# EAGLE design hf-controller (EAGLE 7.4.0)
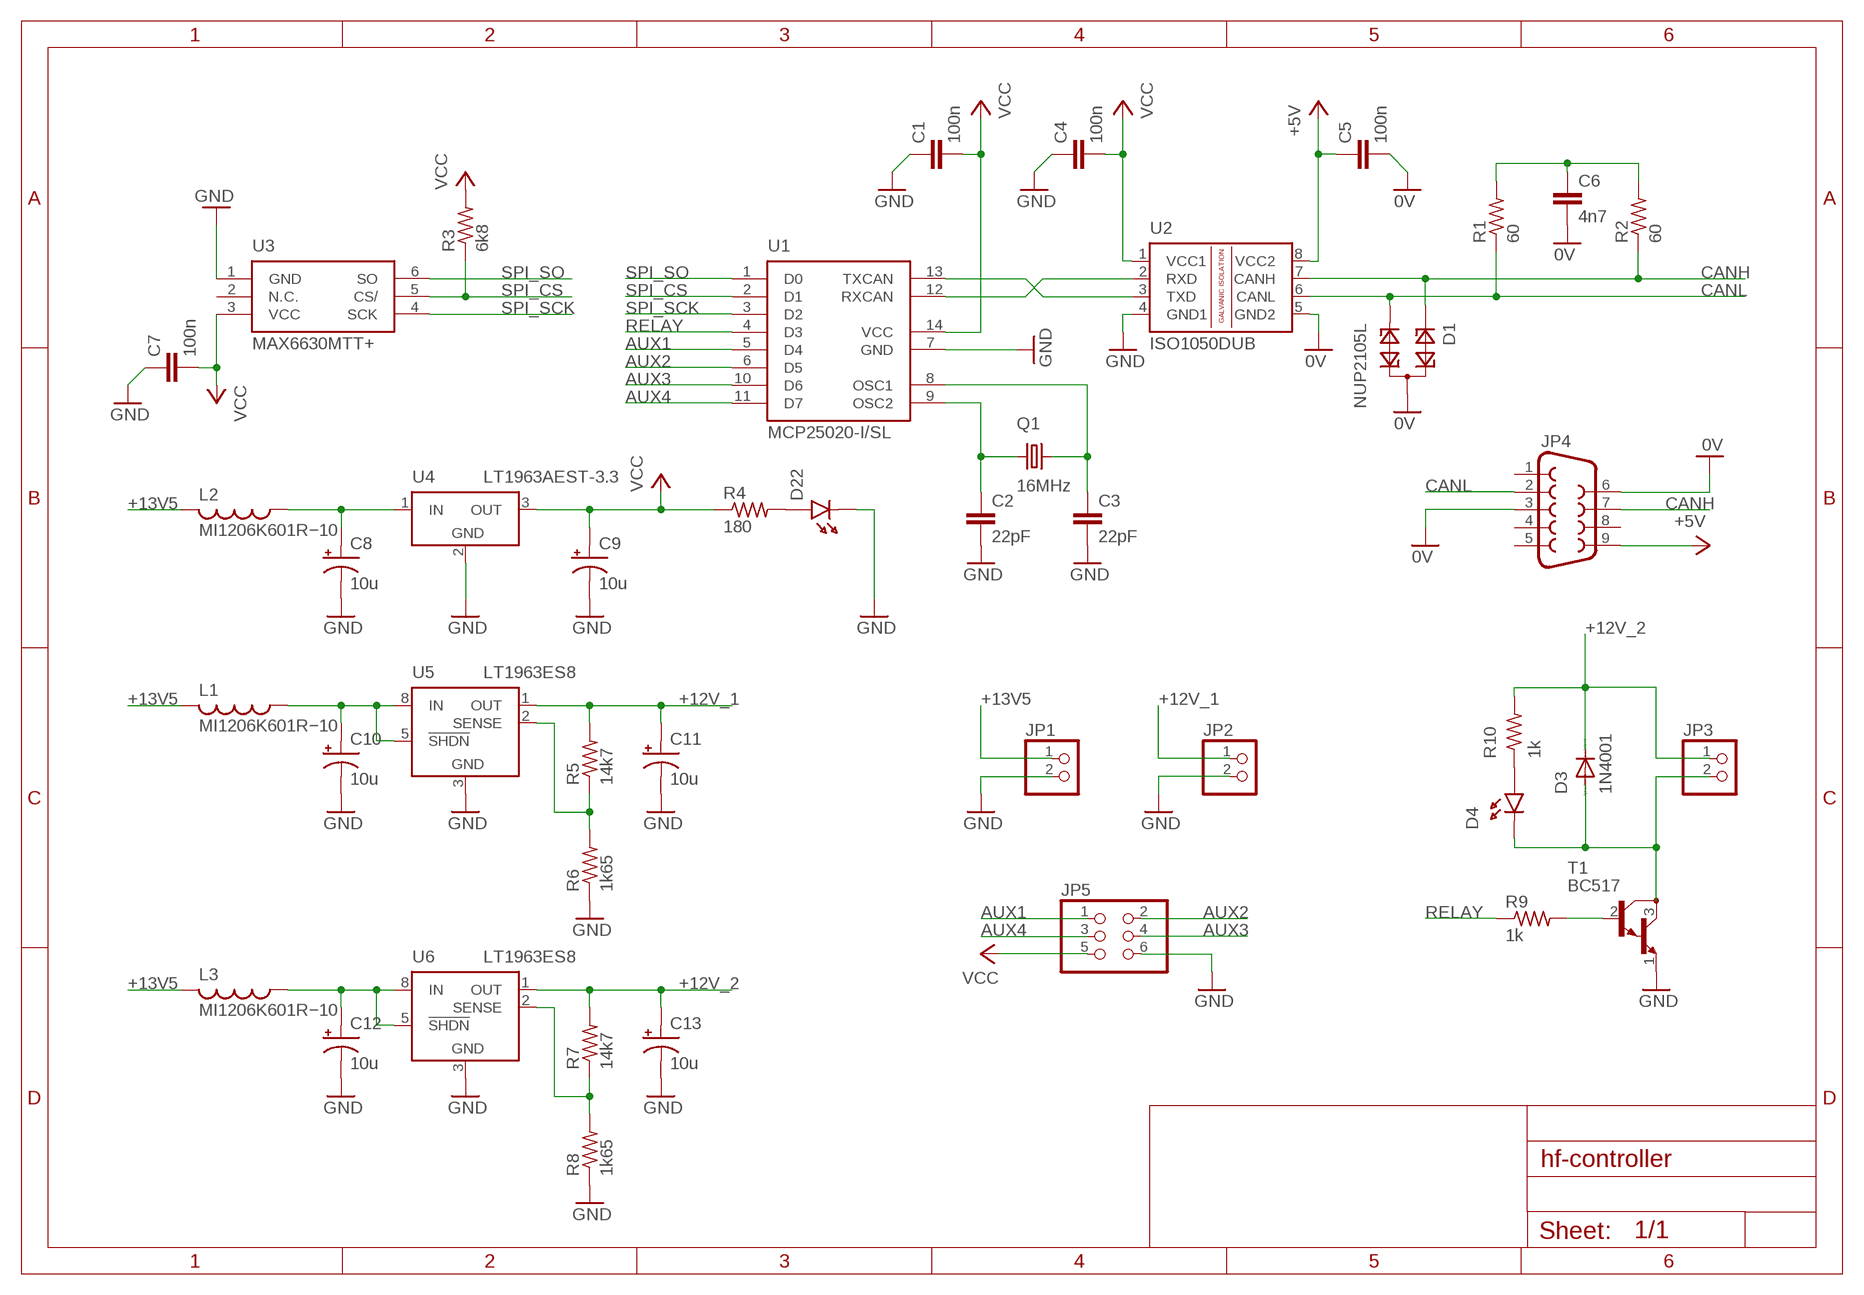
[diagram p0: schematic, sheet 1]

## Parts
C1  100n  C-EUC0805  [C0805]
C2  22pF  C-EUC0805  [C0805]
C3  22pF  C-EUC0805  [C0805]
C4  100n  C-EUC0805  [C0805]
C5  100n  C-EUC0805  [C0805]
C6  4n7  C-EUC0805  [C0805]
C7  100n  C-EUC0805  [C0805]
C8  10u  CAPACITOR_POL1012  [CAPACITOR_POL_1210]
C9  10u  CAPACITOR_POL1012  [CAPACITOR_POL_1210]
C10  10u  CAPACITOR_POL1012  [CAPACITOR_POL_1210]
C11  10u  CAPACITOR_POL1012  [CAPACITOR_POL_1210]
C12  10u  CAPACITOR_POL1012  [CAPACITOR_POL_1210]
C13  10u  CAPACITOR_POL1012  [CAPACITOR_POL_1210]
D1  NUP2105L  PESD1CAN  [SOT23]
D3  1N4001  DIODE-DO41-10  [DO41-10]
D4  LED  [LED_1206]
D22  LED  [LED_1206]
JP1  PINHD-1X2  [1X02]
JP2  PINHD-1X2  [1X02]
JP3  PINHD-1X2  [1X02]
JP4  F09HP  [F09HP]
JP5  PINHD-2X3  [2X03]
L1  MI1206K601R−10  L-USL3216C  [L3216C]
L2  MI1206K601R−10  L-USL3216C  [L3216C]
L3  MI1206K601R−10  L-USL3216C  [L3216C]
Q1  16MHz  CRYSTALHC49S  [HC49/S]
R1  60  R-US_M0805  [M0805]
R2  60  R-US_M0805  [M0805]
R3  6k8  R-US_R0805  [R0805]
R4  180  R-US_R0805  [R0805]
R5  14k7  R-US_R0805  [R0805]
R6  1k65  R-US_R0805  [R0805]
R7  14k7  R-US_R0805  [R0805]
R8  1k65  R-US_R0805  [R0805]
R9  1k  R-US_R0805  [R0805]
R10  1k  R-US_R1206  [R1206]
T1  BC517  [TO92]
U1  MCP25020-I/SL  MCP25050  [MCP25050]
U2  ISO1050DUB  [DUB-R-PDSO-G8]
U3  MAX6630MTT+  [MAX6630MTT+]
U4  LT1963AEST-3.3  LT1963EST-3.3  [SOT223]
U5  LT1963ES8  [SOIC8]
U6  LT1963ES8  [SOIC8]

## Nets
0V: C5.2 C6.2 D1.3 JP4.3 JP4.6 U2.5(GND2)
+5V: C5.1 JP4.9 U2.8(VCC2)
+12V_1: C11.A JP2.1 R5.2 U5.1(OUT)
+12V_2: C13.A D3.C JP3.1 R7.2 R10.2 U6.1(OUT)
+13V5: JP1.1 L1.2 L2.2 L3.2
AUX1: JP5.1 U1.5(D4)
AUX2: JP5.2 U1.6(D5)
AUX3: JP5.4 U1.10(D6)
AUX4: JP5.3 U1.11(D7)
CANH: D1.1 JP4.7 R2.1 U2.7(CANH)
CANL: D1.2 JP4.2 R1.1 U2.6(CANL)
GND: C1.1 C2.2 C3.2 C4.1 C7.1 C8.C C9.C C10.C C11.C C12.C C13.C D22.C JP1.2 JP2.2 JP5.6 R6.1 R8.1 T1.1(E) U1.7(GND) U2.4(GND1) U3.1(GND) U4.2(GND) U5.3(GND) U6.3(GND)
N$1: U1.13(TXCAN) U2.3(TXD)
N$2: U1.12(RXCAN) U2.2(RXD)
N$3: C2.1 Q1.1 U1.9(OSC2)
N$4: C3.1 Q1.2 U1.8(OSC1)
N$5: C10.A L1.1 U5.5(!SHDN) U5.8(IN)
N$6: R9.2 T1.2(B)
N$7: C12.A L3.1 U6.5(!SHDN) U6.8(IN)
N$8: C6.1 R1.2 R2.2
N$9: C8.A L2.1 U4.1(IN)
N$12: D3.A D4.C JP3.2 T1.3(C)
N$13: R7.1 R8.2 U6.2(SENSE)
N$15: R5.1 R6.2 U5.2(SENSE)
N$18: D22.A R4.2
N$19: D4.A R10.1
RELAY: R9.1 U1.4(D3)
SPI_CS: R3.1 U1.2(D1) U3.5(CS/)
SPI_SCK: U1.3(D2) U3.4(SCK)
SPI_SO: U1.1(D0) U3.6(SO)
VCC: C1.2 C4.2 C7.2 C9.A JP5.5 R3.2 R4.1 U1.14(VCC) U2.1(VCC1) U3.3(VCC) U4.3(OUT)
Unconnected: JP4.1 JP4.4 JP4.5 JP4.8 U3.2(N.C.) U5.4(NC) U6.4(NC)

## Power pins joined to a net without a drawn wire
GND: U4.4(GND) U5.6(GND) U5.7(GND) U6.6(GND) U6.7(GND)

## Library data of the parts
C1-C7 = rcl:C-EU: CAPACITOR, European symbol
C8-C13 = hf-controller:CAPACITOR_POL
D1 = diode:PESD1CAN: CAN bus ESD protection diode Source: http://www.nxp.com/documents/data_sheet/PESD1CAN.pdf
D3 = diode:DIODE-: DIODE
D4 D22 = hf-controller:LED
JP1-JP3 = pinhead:PINHD-1X2: PIN HEADER
JP4 = con-subd:F09: SUB-D; OC_FARNELL: unknown; OC_NEWARK: unknown
JP5 = pinhead:PINHD-2X3: PIN HEADER
L1-L3 = rcl:L-US: INDUCTOR, American symbol
Q1 = crystal:CRYSTAL: CRYSTAL; OC_FARNELL: 1667008; OC_NEWARK: unknown
R1-R3 R5-R8 R10 = resistor:R-US_: RESISTOR, American symbol
R4 R9 = rcl:R-US_: RESISTOR, American symbol
T1 = transistor:BC517: NPN BIPOLAR DARLINGTON TRANSISTOR
U1 = hf-controller:MCP25050
U2 = texas:ISO1050: ISOLATED CAN TRANSCEIVER Source: http://focus.ti.com/lit/ds/symlink/iso1050.pdf; MPN: ISO1050DUBR; OC_FARNELL: 1755712; OC_NEWARK: 14R9899
U3 = hf-controller:MAX6630MTT+
U4 = linear-technology:LT1963EST: 1.5A, Low Noise, Fast Transient Response LDO Regulator Source: http://www.linear.com/pc/downloadDocument.do?navId=H0,C3,P2222,D3148; MPN: LT1963EST-3.3; OC_FARNELL: 1501032; OC_NEWARK: 57M7546
U5 U6 = linear-technology:LT1963ES8: 1.5A, Low Noise, Fast Transient Response LDO Regulator Source: http://www.linear.com/pc/downloadDocument.do?navId=H0,C3,P2222,D3148; MPN: LT1963ES8; OC_FARNELL: unknown; OC_NEWARK: 57M7550

## Board
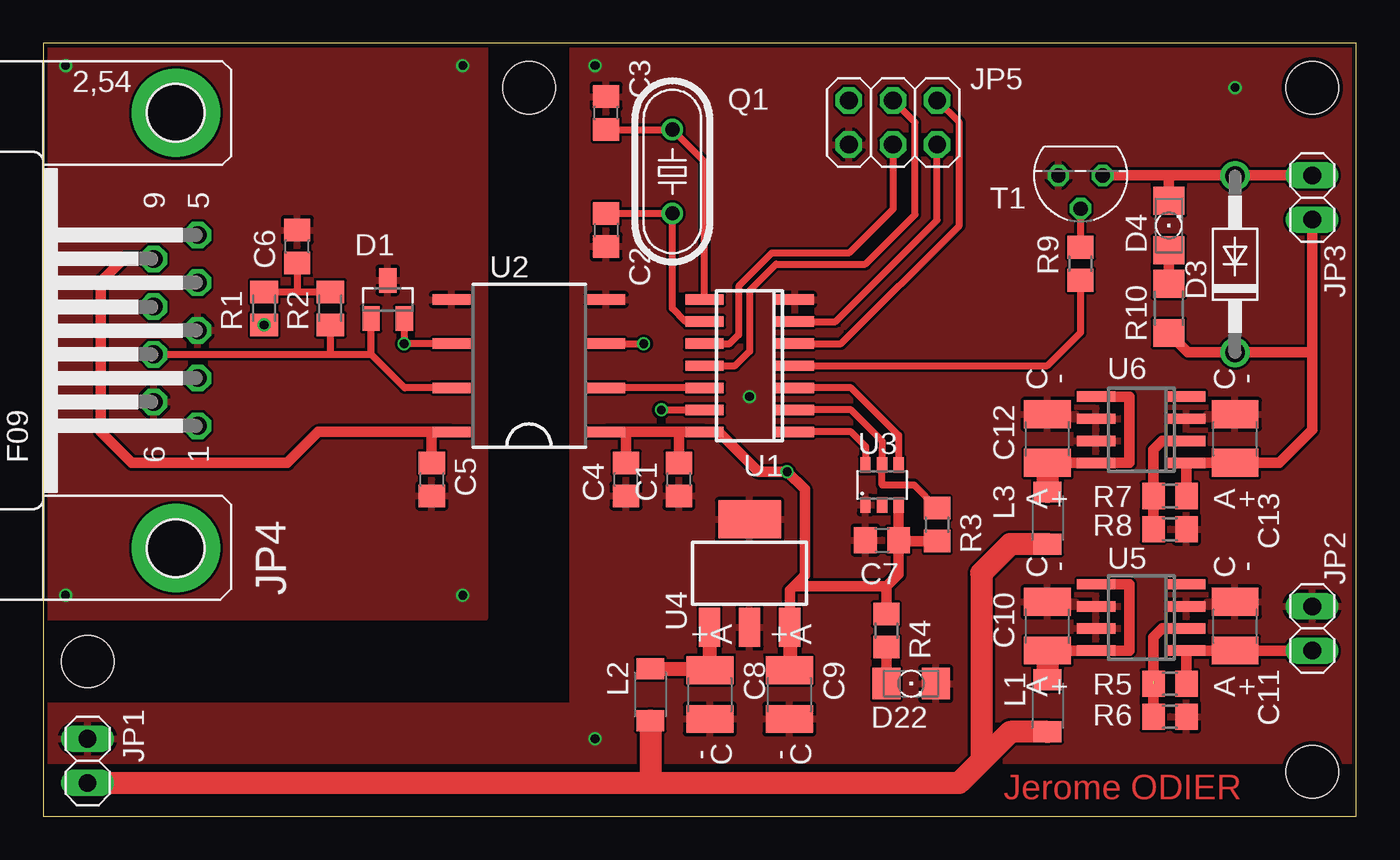
[diagram p1: board, top side]
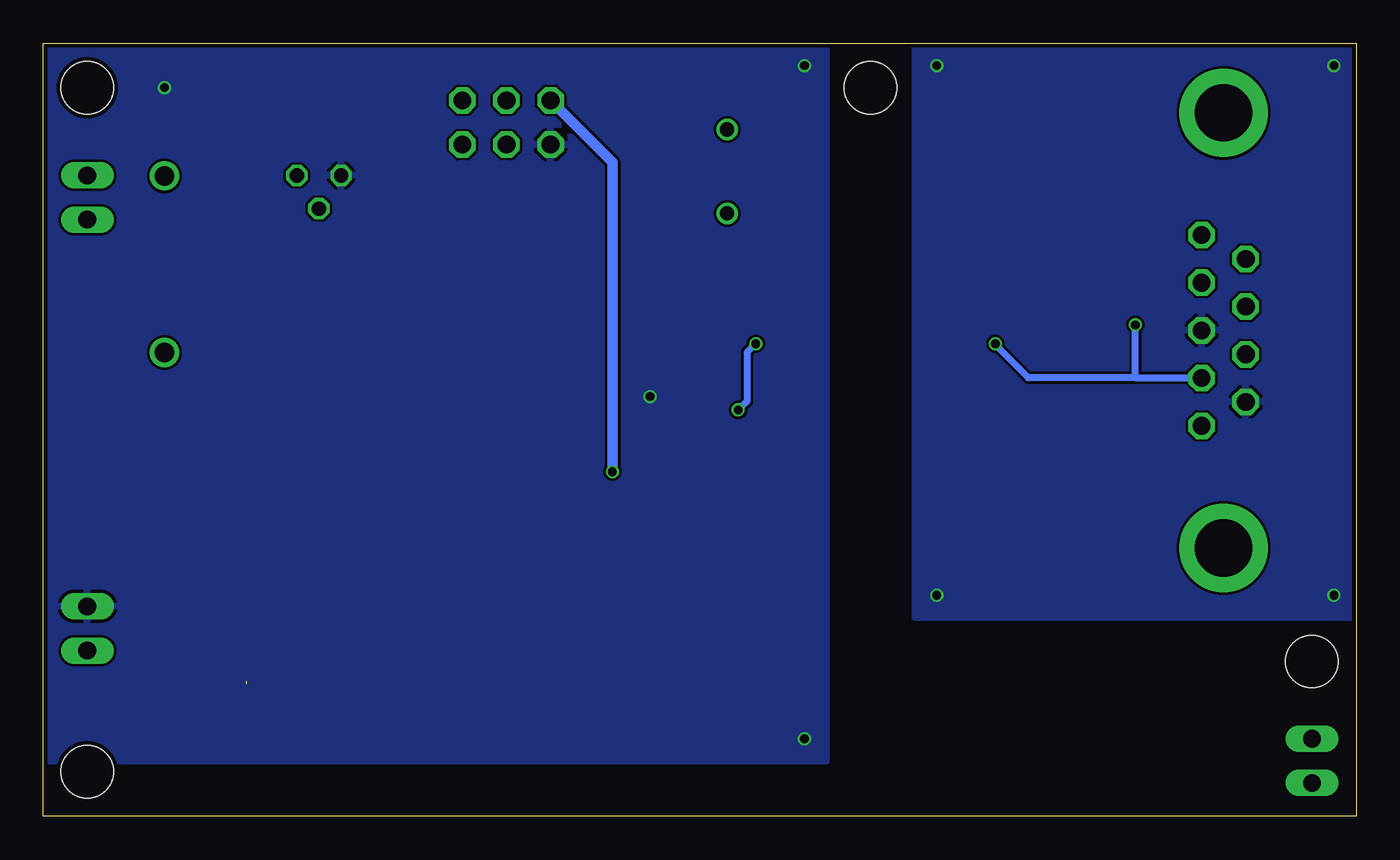
[diagram p2: board, bottom side, seen from below]

Size 75.55 x 44.45 mm. Coordinates in mm from the lower left corner, seen from the top.
Outline: 0,0 75.55,0 75.55,44.45 0,44.45 0,0
Copper layers (1*16): Top 0.018mm / dielectric 1.55mm / Bottom 0.018mm
Design rules "eC_2Layer_PClass6_BaseCopperO18_eCDefault": minimum track width 0.15mm, minimum drill 0.35mm, track to track 0.15mm, track to pad 0.15mm, pad to pad 0.15mm, via to via 0.15mm, smd to smd 0mil, copper to edge 0.25mm, drill to drill 0.35mm, minimum pad ring 0.175mm, minimum via ring 0.125mm, stop-mask expansion 0mil, vias tented up to drill 0.45mm, thermal gap 0.2mm
Holes 3 mm at 2.54,8.89 73.03,2.54 73.03,41.91 27.94,41.91

### Footprints (pad centres in the part's own frame; a part is rotated, then mirrored left to right if it is on the bottom)
C0805 = smd 1.3 x 1.5: 1 -0.95,0; 2 0.95,0
CAPACITOR_POL_1210 = smd 1.6 x 2.7: A -1.4,0; C 1.4,0
SOT23 = smd 1 x 1.4: 1 -0.95,-1.1; 2 0.95,-1.1; 3 0,1.1
DO41-10 = drill 1.118: A 5.08,0; C -5.08,0
LED_1206 = smd 1.6 x 1.803: A -1.422,0; C 1.422,0
1X02 = drill 1.016 long: 1 -1.27,0; 2 1.27,0
F09HP = drill 1.016 octagon: 1 -5.486,-1.27; 2 -2.743,-1.27; 3 0,-1.27; 4 2.743,-1.27; 5 5.486,-1.27; 6 -4.115,1.27; 7 -1.372,1.27; 8 1.372,1.27; 9 4.115,1.27 | drill 3.302 pad 5.08: G1 -12.522,0; G2 12.522,0
2X03 = drill 1.016 octagon: 1 -2.54,-1.27; 2 -2.54,1.27; 3 0,-1.27; 4 0,1.27; 5 2.54,-1.27; 6 2.54,1.27
L3216C = smd 1.2 x 1.6: 1 -1.5,0; 2 1.5,0
HC49/S = drill 0.813: 1 -2.413,0; 2 2.413,0
M0805 = smd 1.3 x 1.6: 1 -0.95,0; 2 0.95,0
R0805 = smd 1.3 x 1.5: 1 -0.95,0; 2 0.95,0
R1206 = smd 1.6 x 1.803: 1 -1.422,0; 2 1.422,0
TO92 = drill 0.813 octagon: 1 1.27,0; 2 0,1.905; 3 -1.27,0
MCP25050 = smd 0.6 x 2.2: 1 0,-0.06; 2 1.27,-0.06; 3 2.54,-0.06; 4 3.81,-0.06; 5 5.08,-0.06; 6 6.35,-0.06; 7 7.62,-0.06; 8 7.62,5.14; 9 6.35,5.14; 10 5.08,5.14; 11 3.81,5.14; 12 2.54,5.14; 13 1.27,5.14; 14 0,5.14
DUB-R-PDSO-G8 = smd 0.6 x 2.2: 1 -3.81,-4.445; 2 -1.27,-4.445; 3 1.27,-4.445; 4 3.81,-4.445; 5 3.81,4.445; 6 1.27,4.445; 7 -1.27,4.445; 8 -3.81,4.445
MAX6630MTT+ = smd 0.6 x 0.9: 1 -0.95,-1.15; 2 0,-1.15; 3 0.95,-1.15; 4 0.95,1.15; 5 0,1.15; 6 -0.95,1.15
SOT223 = smd 1.219 x 2.235: 1 -2.311,-3.099; 2 0,-3.099; 3 2.311,-3.099 | smd 3.6 x 2.2: 4 0,3.099
SOIC8 = smd 0.6 x 2.2: 1 -1.905,-2.6; 2 -0.635,-2.6; 3 0.635,-2.6; 4 1.905,-2.6; 5 1.905,2.6; 6 0.635,2.6; 7 -0.635,2.6; 8 -1.905,2.6

### Placement (x,y rotation side)
C1  36.58,19.37 90 top
C2  32.38,33.72 270 top
C3  32.38,40.45 90 top
C4  33.53,19.37 90 top
C5  22.35,19.37 270 top
C6  14.61,32.77 90 top
C7  48.26,15.88 0 top
C8  38.35,6.99 270 top
C9  42.93,6.99 270 top
C10  57.78,10.92 90 top
C11  68.58,10.92 90 top
C12  57.78,21.72 90 top
C13  68.58,21.72 90 top
D1  19.81,29.72 0 top
D3  68.58,31.75 90 top
D4  64.77,33.97 90 top
D22  49.94,7.62 0 top
JP1  2.54,3.17 90 top
JP2  73.03,10.79 90 top
JP3  73.03,35.59 90 top
JP4  7.62,27.94 90 top
JP5  48.9,39.9 180 top
L1  57.78,6.35 270 top
L2  34.92,6.99 270 top
L3  57.78,17.14 270 top
Q1  36.2,37.08 90 top
R1  12.7,29.21 90 top
R2  16.51,29.21 90 top
R3  51.44,16.76 270 top
R4  48.51,10.67 270 top
R5  64.83,7.62 0 top
R6  64.83,5.71 180 top
R7  64.83,18.41 0 top
R8  64.83,16.51 180 top
R9  59.69,31.78 90 top
R10  64.77,29.21 270 top
T1  59.69,36.86 180 top
U1  43.18,22.1 90 top
U2  27.94,25.91 90 top
U3  48.26,19.05 0 top
U4  40.64,13.97 0 top
U5  63.18,11.43 90 top
U6  63.18,22.23 90 top

### Tracks (layer width: path | path; a pad name or v marks a point on that pad's centre or on a via)
0V  (via drill 0.5)
  other vias: 24.13,43.18 24.13,12.7 1.27,12.7 1.27,43.18
  pour Bottom: 0,44.45 25.4,44.45 25.4,11.43 0,11.43
  pour Top: 0,44.45 25.4,44.45 25.4,11.43 0,11.43
+5V
  Top 0.61: JP4.9 4.62,32.05 3.3,30.73 3.3,22.1 5.08,20.32 14.03,20.32 15.81,22.1 22.35,22.1 | U2.8 22.35,22.1 | C5.1 22.35,22.1
+12V_1
  Top 0.406: R5.2 | C11.A | JP2.1
  Top 0.61: R5.2 U5.1 C11.A | C11.A JP2.1
+12V_2
  Top 0.406: R7.2 | 69.22,26.7 D3.C
  Top 0.61: R7.2 U6.1 C13.A 71.12,20.32 73.03,22.23 73.03,26.67 | JP3.1 73.03,26.67 | R10.2 65.86,26.7 69.22,26.7 | D3.C 73.03,26.67
+13V5
  Top 1.27: JP1.1 34.92,1.91 | 34.92,1.91 52.7,1.91 53.98,3.17 | L3.2 55.65,15.64 53.98,13.97 53.98,3.17 | L1.2 55.65,4.85 53.98,3.17 | L2.2 34.92,1.91
AUX1
  Top 0.406: U1.5 45.91,27.18 52.7,33.97 52.7,39.9 JP5.1
AUX2
  Top 0.406: U1.6 45.59,28.45 51.44,34.29 JP5.2
AUX3
  Top 0.406: U1.10 39.5,27.18 40.01,27.69 40.01,30.48 41.91,32.38 46.35,32.38 48.9,34.92 JP5.4
AUX4
  Top 0.406: U1.11 39.81,25.91 40.64,26.73 40.64,30.23 42.16,31.75 47.31,31.75 50.16,34.61 50.16,39.9 JP5.3
CANH
  Top 0.406: JP4.7 16.51,26.57 | 16.51,26.57 18.86,26.57 | R2.1 16.51,26.57 | 18.86,26.57 D1.1 | U2.7 20.79,24.64 18.86,26.57
CANL  (via drill 0.5)
  Top 0.406: U2.6 v20.76,27.18 D1.2
  Bottom 0.406: 12.7,25.21 18.86,25.21 20.76,27.11 v20.76,27.18 | 12.7,25.21 R1.1 | 12.7,25.21 JP4.2
  other vias: 12.7,28.26
GND  (via drill 0.5)
  other vias: 40.64,24.13 31.75,43.18 31.75,4.45 68.58,41.91
  pour Top: 0,6.35 30.48,6.35 30.48,44.45 75.56,44.45 75.56,3.17 0,3.17
  pour Bottom: 30.48,44.45 75.56,44.45 75.56,3.17 30.48,3.17
N$1  (via drill 0.5)
  Top 0.406: U2.3 v34.54,27.18 | v35.56,23.37 U1.13
  Bottom 0.406: v34.54,27.18 35.05,26.67 35.05,23.88 v35.56,23.37
N$2
  Top 0.406: U1.12 U2.2
N$3
  Top 0.406: U1.9 36.96,28.45 36.2,29.21 Q1.1 C2.1
N$4
  Top 0.406: U1.8 38.04,37.65 Q1.2 C3.1
N$5
  Top 0.406: U5.8 | C10.A
  Top 0.61: U5.8 62.48,9.53 62.48,13.34 U5.5 | C10.A U5.8
  Top 1.27: C10.A L1.1
N$6
  Top 0.406: T1.2 R9.2
N$7
  Top 0.61: C12.A U6.8 62.48,20.32 62.48,24.13 U6.5
  Top 1.27: C12.A L3.1
N$8
  Top 0.406: R1.2 14.61,30.16 | 14.61,30.16 R2.2 | C6.1 14.61,30.16
N$9
  Top 0.406: 38.1,11.51 U4.1 38.23,11.4
  Top 0.813: U4.1 38.33,8.41 C8.A 38.25,8.48 L2.1
N$12
  Top 0.406: 69.22,36.85 D3.A
  Top 0.61: 64.77,36.85 T1.3 | D4.C 64.77,36.85 | JP3.2 69.22,36.85 64.77,36.85
N$13
  Top 0.61: R8.2 R7.1 63.88,21.08 64.39,21.59 U6.2
N$15  (1 unrouted)
  Top 0.406: 63.88,7.75
  Top 0.61: U5.2 64.39,10.79 63.88,10.29 63.88,7.75 | 63.88,7.75 R6.2
N$18
  Top 0.406: R4.2
  Top 0.61: R4.2 D22.A
N$19
  Top 0.61: R10.1 D4.A
RELAY
  Top 0.406: U1.4 57.78,25.91 59.69,27.81 R9.1
SPI_CS
  Top 0.406: R3.1 50.1,19.05 48.26,19.05 U3.5 48.26,21.59 46.48,23.37 U1.2
SPI_SCK
  Top 0.406: U1.3 46.48,24.64 49.21,21.91 U3.4
SPI_SO
  Top 0.406: U1.1 46.48,22.1 47.31,21.27 U3.6
VCC  (via drill 0.5)
  Top 0.406: 49.27,15.81 C7.2 | U4.3 42.95,11.43 | 43.03,11.43 U4.3 | 43.05,11.4 U4.3 | 42.98,12.95 42.95,12.98
  Top 0.61: C1.2 36.58,22.1 | C4.2 33.53,22.1 | U3.3 C7.2 49.21,13.9 48.51,13.21 | R3.2 49.27,15.81 | U4.3 42.95,12.98 | 42.95,12.98 43.2,13.21 48.51,13.21 | 36.58,22.1 U1.14 38.86,22.1 41.15,19.81 v42.8,19.81 43.81,18.8 43.81,13.84 42.95,12.98 | 36.58,22.1 33.53,22.1 | 33.53,22.1 U2.1 | 48.51,13.21 R4.1
  Top 0.813: U4.3 42.95,8.41 C9.A
  Bottom 0.61: JP5.5 42.8,37.62 v42.8,19.81

### Text on the board
Top: Jerome ODIER